# EAGLE design miavita (EAGLE 6.5.0)
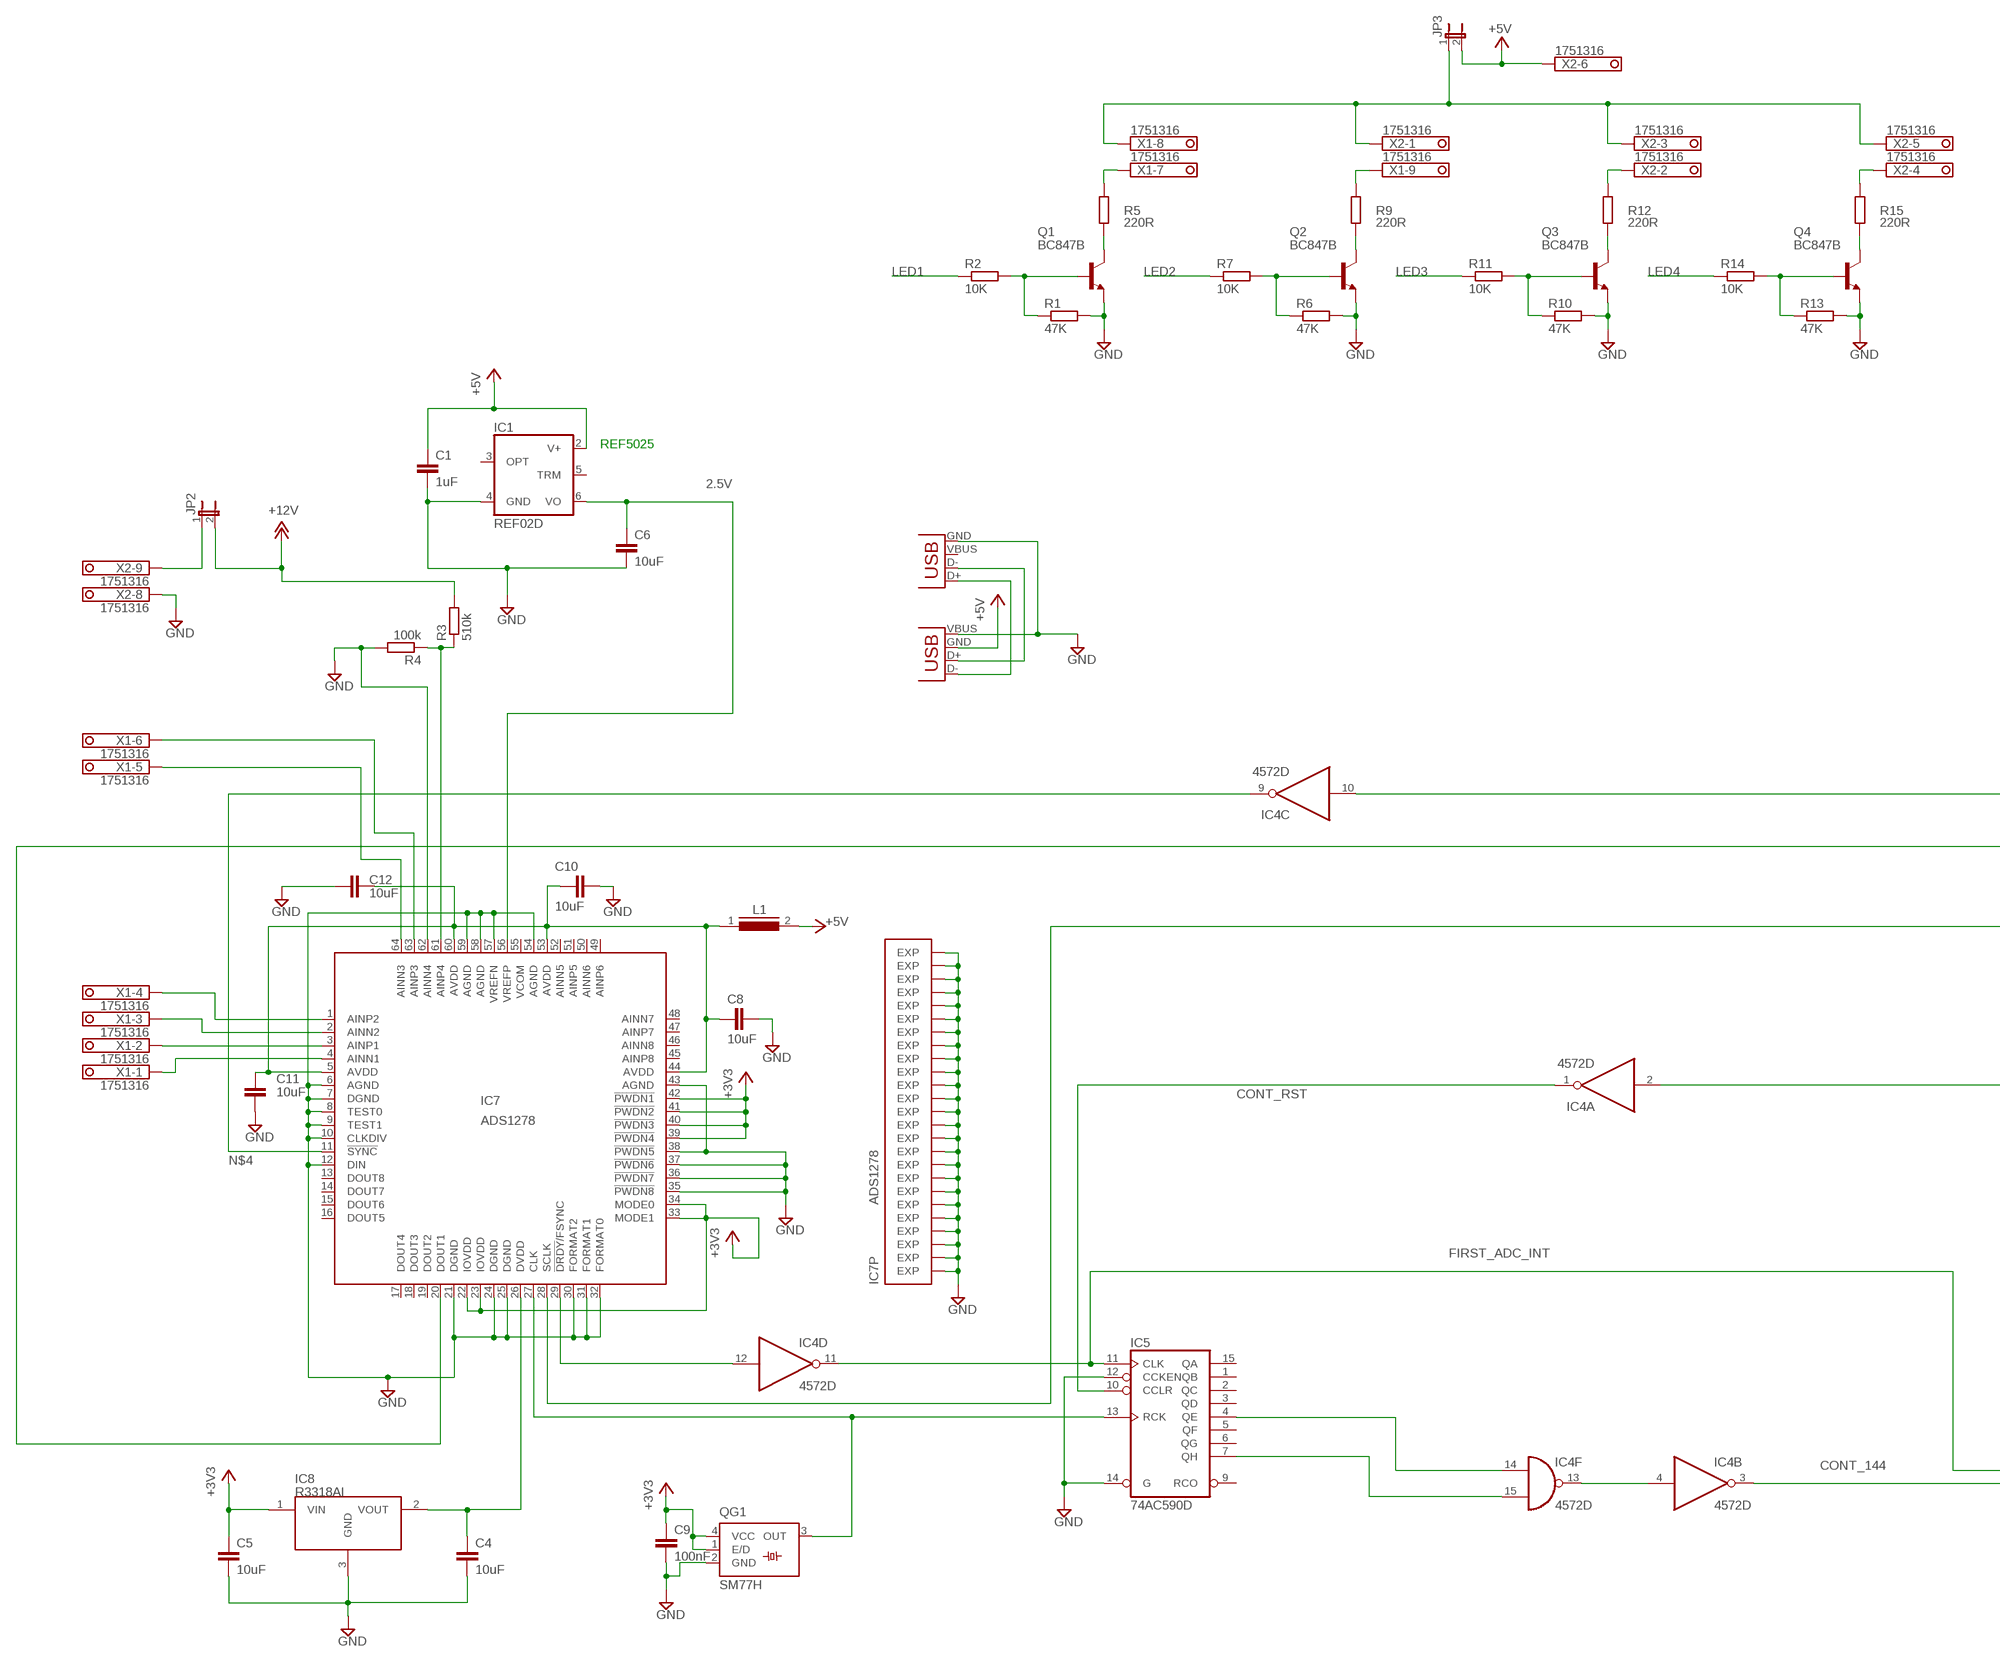
[diagram p0: schematic, sheet 1, part 1 of 2]
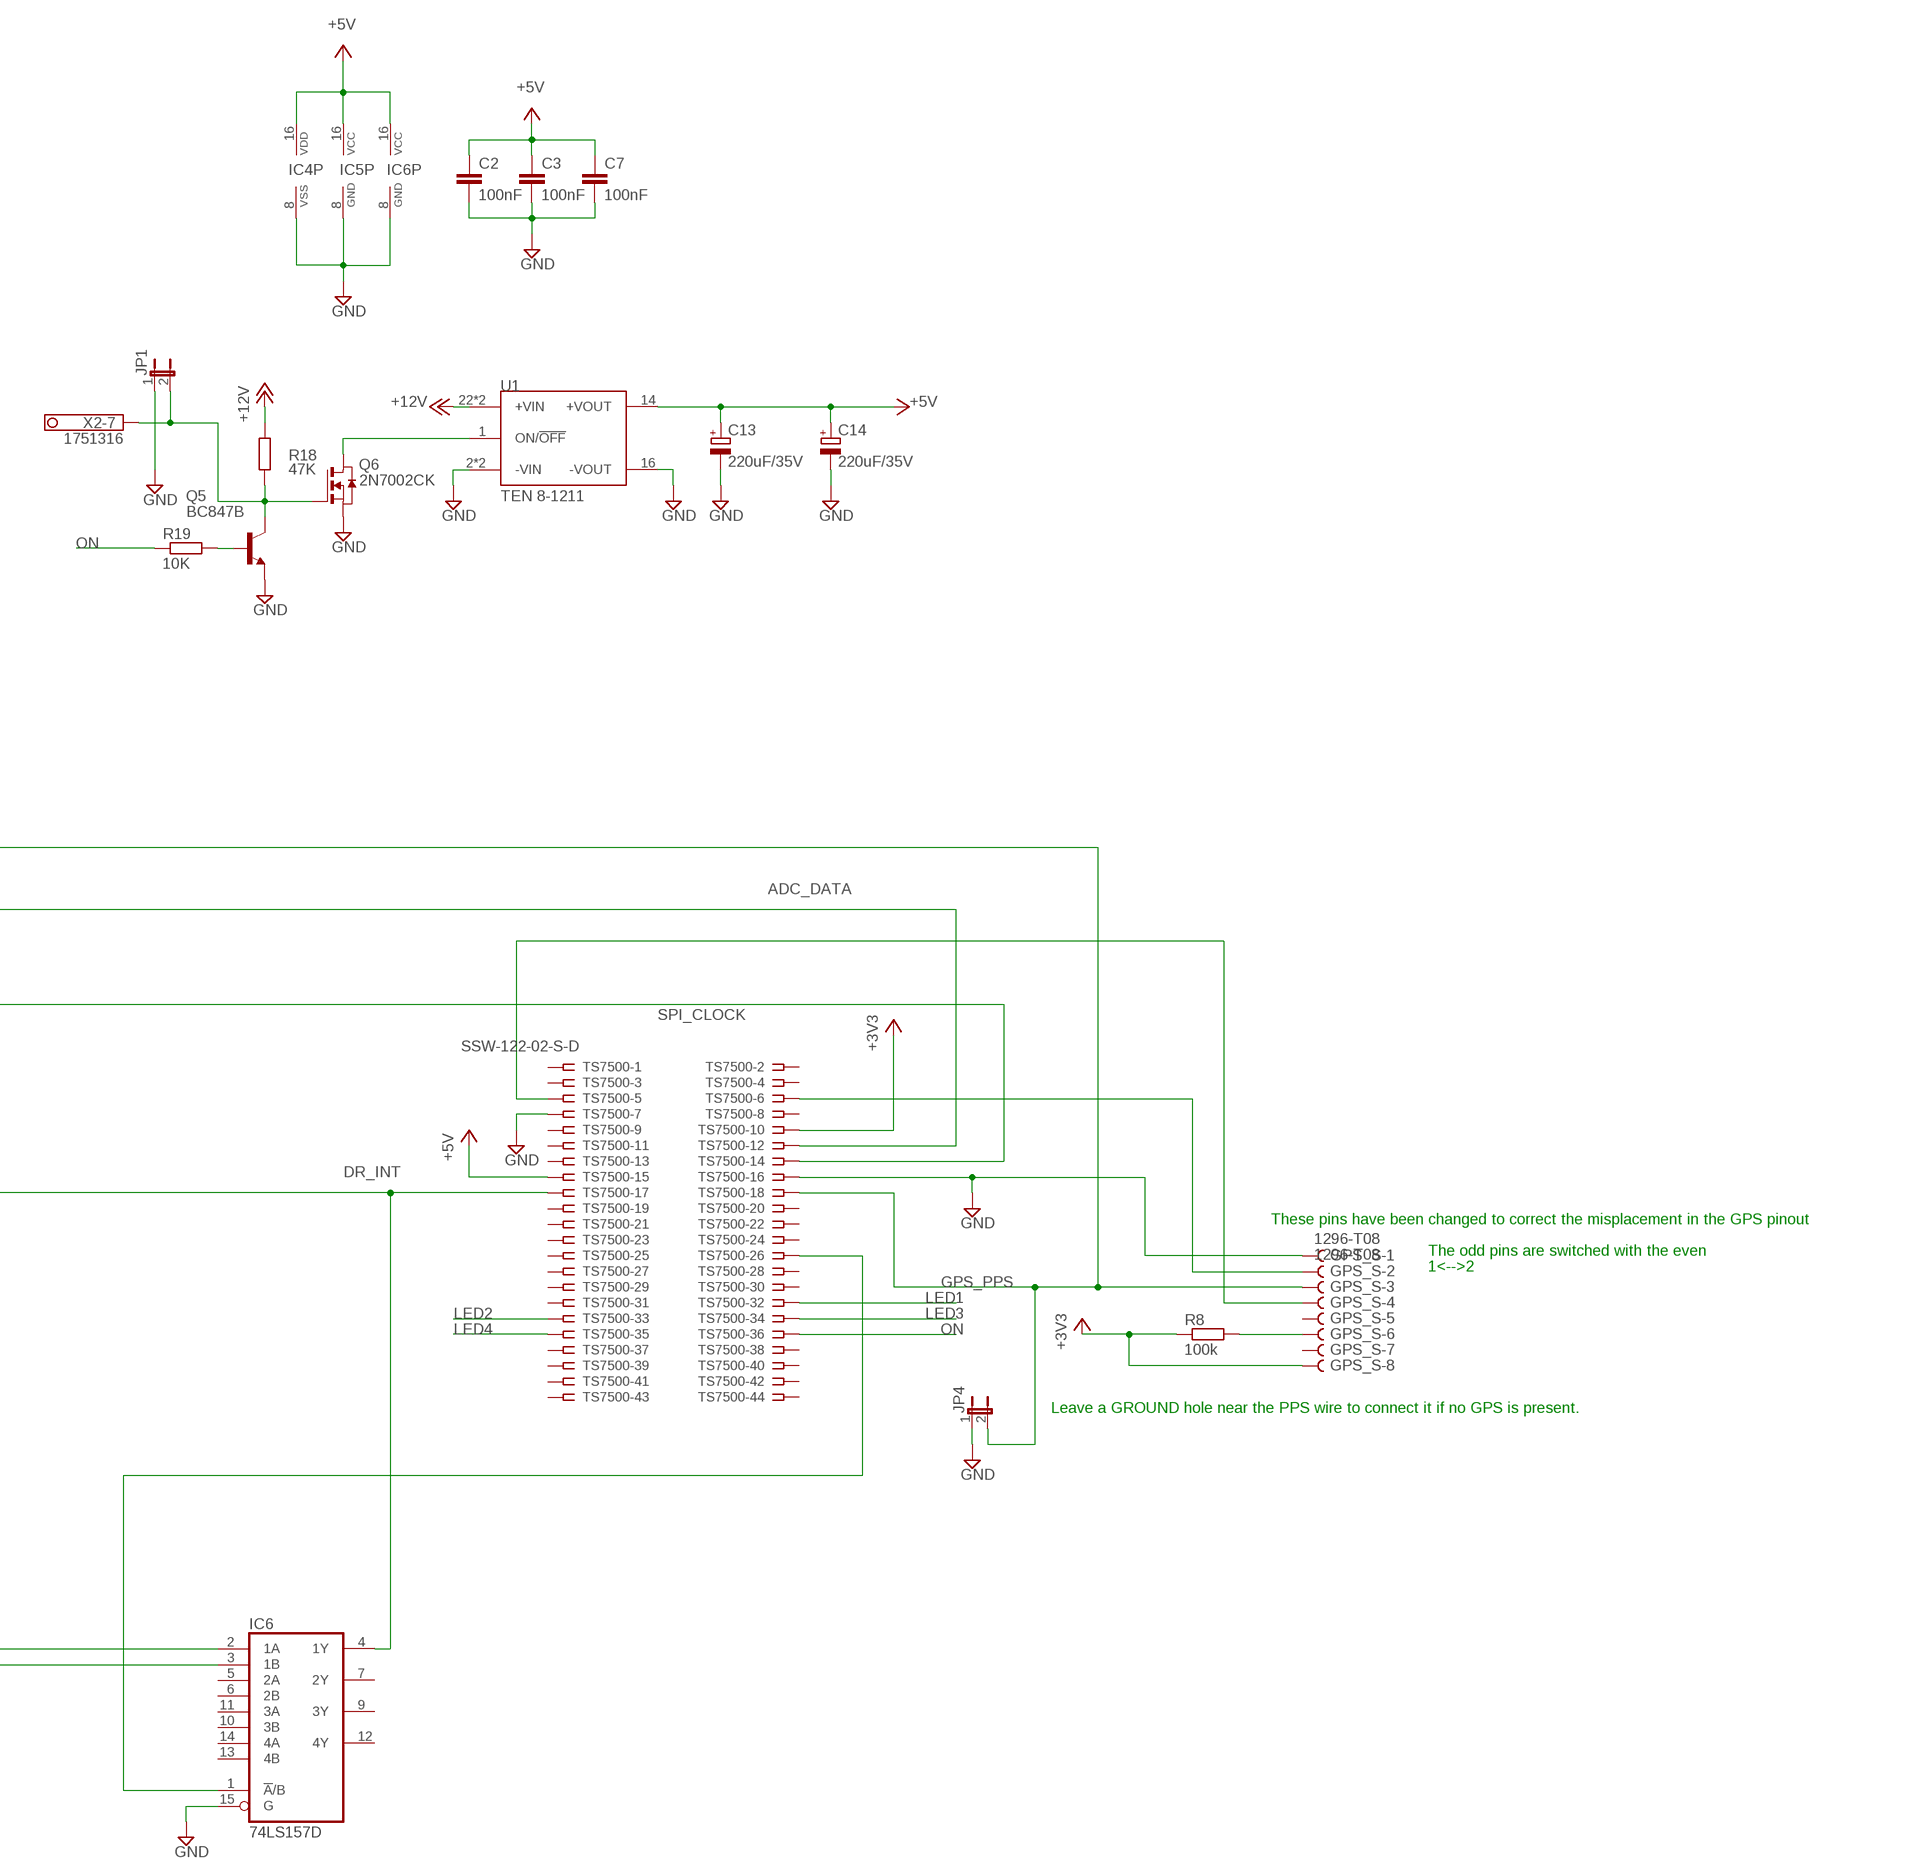
[diagram p1: schematic, sheet 1, part 2 of 2]

## Parts
C1  1uF  C-EUC0603  [C0603]
C2  100nF  C-EUC0603  [C0603]
C3  100nF  C-EUC0603  [C0603]
C4  10uF  C-EUC1210  [C1210]
C5  10uF  C-EUC1210  [C1210]
C6  10uF  C-EUC1210  [C1210]
C7  100nF  C-EUC0603  [C0603]
C8  10uF  C-EUC0805  [C0805]
C9  100nF  C-EUC0603  [C0603]
C10  10uF  C-EUC0805  [C0805]
C11  10uF  C-EUC0805  [C0805]
C12  10uF  C-EUC0805  [C0805]
C13  220uF/35V  CPOL-EUUD-10X10  [UD-10X10_NICHICON]
C14  220uF/35V  CPOL-EUUD-10X10  [UD-10X10_NICHICON]
GPS_S  1296-T08  [1296-08]
IC1  REF02D  [SO08]
IC4  4572D  [SO16]
IC5  74AC590D  [SO16]
IC6  74LS157D  [SO16]
IC7  ADS1278  [HTQFP-64-PAP]
IC8  R3318AI  MCP1525T-I/TT  [SOT23]
JP1  JP1E  [JP1]
JP2  JP1E  [JP1]
JP3  JP1E  [JP1]
JP4  JP1E  [JP1]
L1  FAIR-RITE_2506031027Y0  [L0603]
Q1  BC847B  BC847BLT1SMD  [SOT23]
Q2  BC847B  BC847BLT1SMD  [SOT23]
Q3  BC847B  BC847BLT1SMD  [SOT23]
Q4  BC847B  BC847BLT1SMD  [SOT23]
Q5  BC847B  BC847BLT1SMD  [SOT23]
Q6  2N7002CK  [SOT23]
QG1  SM77H  [SM77H]
R1  47K  R-EU_R0603  [R0603]
R2  10K  R-EU_R0603  [R0603]
R3  510k  R-EU_R0603  [R0603]
R4  100k  R-EU_R0603  [R0603]
R5  220R  R-EU_R0603  [R0603]
R6  47K  R-EU_R0603  [R0603]
R7  10K  R-EU_R0603  [R0603]
R8  100k  R-EU_R0603  [R0603]
R9  220R  R-EU_R0603  [R0603]
R10  47K  R-EU_R0603  [R0603]
R11  10K  R-EU_R0603  [R0603]
R12  220R  R-EU_R0603  [R0603]
R13  47K  R-EU_R0603  [R0603]
R14  10K  R-EU_R0603  [R0603]
R15  220R  R-EU_R0603  [R0603]
R18  47K  R-EU_R0603  [R0603]
R19  10K  R-EU_R0603  [R0603]
TS7500  SSW-122-02-S-D  [SSW-122-02-S-D]
U1  TEN 8-1211  TRACOPOWER_TEN-8-1211  [TRACOPOWER_TEN-8-SERIES]
USBA  USB-A-H  [USB-A-H]
USBB  USBPTH  [USB-B-PTH]
X1  1751316  [1751316]
X2  1751316  [1751316]

## Nets
2.5V: C6.1 IC1.6(VO) IC7.56(VREFP)
+1V8: C4.1 IC7.26(DVDD) IC8.2(VOUT)
+3V3: C5.1 C9.1 GPS_S.8 IC7.22(IOVDD) IC7.23(IOVDD) IC7.33(MODE1) IC7.34(MODE0) IC7.39(!PWDN4) IC7.40(!PWDN3) IC7.41(!PWDN2) IC7.42(!PWDN1) IC8.1(VIN) QG1.1(E/D) QG1.4(VCC) R8.1 TS7500.10
+5V: C1.1 C2.1 C3.1 C7.1 C13.+ C14.+ IC1.2(V+) IC4.16(P:VDD) IC5.16(VCC) IC6.16(VCC) JP3.2 L1.2 TS7500.15 U1.14(+VOUT) USBA.GND(VBUS) X2.6
+12V: JP2.2 R3.2 R18.1 U1.22(+VIN) U1.23(+VIN)
ADC_DATA: IC7.20(DOUT1) TS7500.12
CONT_144: IC4.3(B:O) IC6.3(1B)
CONT_RST: IC4.1(A:O) IC5.10(CCLR)
DR_INT: IC4.2(A:I) IC6.4(1Y) TS7500.17
FIRST_ADC_INT: IC4.11(D:O) IC5.11(CLK) IC6.2(1A)
GND: C1.2 C2.2 C3.2 C4.2 C5.2 C6.2 C7.2 C8.2 C9.2 C10.2 C11.2 C12.2 C13.- C14.- GPS_S.1 IC1.4(GND) IC4.8(P:VSS) IC5.8(GND) IC5.12(CCKEN) IC5.14(G) IC6.8(GND) IC6.15(G) IC7.6(AGND) IC7.7(DGND) IC7.8(TEST0) IC7.9(TEST1) IC7.10(CLKDIV) IC7.12(DIN) IC7.21(DGND) IC7.24(DGND) IC7.25(DGND) IC7.30(FORMAT2) IC7.31(FORMAT1) IC7.32(FORMAT0) IC7.35(!PWDN8) IC7.36(!PWDN7) IC7.37(!PWDN6) IC7.38(!PWDN5) IC7.43(AGND) IC7.54(AGND) IC7.57(VREFN) IC7.58(AGND) IC7.59(AGND) IC7.62(AINN4) IC7.EXP1(EXP) IC7.EXP2(EXP) IC7.EXP3(EXP) IC7.EXP4(EXP) IC7.EXP5(EXP) IC7.EXP6(EXP) IC7.EXP7(EXP) IC7.EXP8(EXP) IC7.EXP9(EXP) IC7.EXP10(EXP) IC7.EXP11(EXP) IC7.EXP12(EXP) IC7.EXP13(EXP) IC7.EXP14(EXP) IC7.EXP15(EXP) IC7.EXP16(EXP) IC7.EXP17(EXP) IC7.EXP18(EXP) IC7.EXP19(EXP) IC7.EXP20(EXP) IC7.EXP21(EXP) IC7.EXP22(EXP) IC7.EXP23(EXP) IC7.EXP24(EXP) IC7.EXP25(EXP) IC8.3(GND) JP1.1 JP4.1 Q1.2(E) Q2.2(E) Q3.2(E) Q4.2(E) Q5.2(E) Q6.2(S) QG1.2(GND) R1.2 R4.2 R6.2 R10.2 R13.2 TS7500.7 TS7500.16 U1.2(-VIN) U1.3(-VIN) U1.16(-VOUT) USBA.VBUS(GND) USBB.GND X2.8
GPS_PPS: GPS_S.3 IC4.10(C:I) JP4.2 TS7500.18
LED1: R2.1 TS7500.32
LED2: R7.1 TS7500.33
LED3: R11.1 TS7500.34
LED4: R14.1 TS7500.35
N$1: IC6.1(!A!/B) TS7500.26
N$2: IC4.15(F:I1) IC5.7(QH)
N$3: IC4.14(F:I0) IC5.4(QE)
N$4: IC4.9(C:O) IC7.11(!SYNC)
N$5: IC4.4(B:I) IC4.13(F:O)
N$7: IC4.12(D:I) IC7.29(!DRDY!/FSYNC)
N$8: IC7.3(AINP1) X1.2
N$9: Q5.1(B) R19.2
N$10: IC7.4(AINN1) X1.1
N$11: IC7.1(AINP2) X1.4
N$12: IC7.61(AINP4) R3.1 R4.1
N$13: USBA.D+(D-) USBB.D-
N$14: IC7.63(AINP3) X1.6
N$15: Q2.1(B) R6.1 R7.2
N$16: Q2.3(C) R9.1
N$17: IC5.13(RCK) IC7.27(CLK) QG1.3(OUT)
N$18: USBA.D-(D+) USBB.D+
N$19: C8.1 C10.1 C11.1 C12.1 IC7.5(AVDD) IC7.44(AVDD) IC7.53(AVDD) IC7.60(AVDD) L1.1
N$20: R9.2 X1.9
N$21: Q3.1(B) R10.1 R11.2
N$22: Q3.3(C) R12.1
N$23: R12.2 X2.2
N$24: Q4.1(B) R13.1 R14.2
N$25: Q4.3(C) R15.1
N$26: R15.2 X2.4
N$27: JP2.1 X2.9
N$28: JP3.1 X1.8 X2.1 X2.3 X2.5
N$29: IC7.2(AINN2) X1.3
N$31: JP1.2 Q5.3(C) Q6.1(G) R18.2 X2.7
N$32: Q6.3(D) U1.1(ON/!OFF)
N$34: IC7.64(AINN3) X1.5
N$37: Q1.3(C) R5.1
N$39: Q1.1(B) R1.1 R2.2
N$40: R5.2 X1.7
N$42: GPS_S.2 TS7500.6
N$43: GPS_S.4 TS7500.5
N$44: GPS_S.6 R8.2
ON: R19.1 TS7500.36
SPI_CLOCK: IC7.28(SCLK) TS7500.14
Unconnected: GPS_S.5 GPS_S.7 IC1.3(OPT) IC1.5(TRM) IC4.5(E:O) IC4.6(E:I0) IC4.7(E:I1) IC5.1(QB) IC5.2(QC) IC5.3(QD) IC5.5(QF) IC5.6(QG) IC5.9(RCO) IC5.15(QA) IC6.5(2A) IC6.6(2B) IC6.7(2Y) IC6.9(3Y) IC6.10(3B) IC6.11(3A) IC6.12(4Y) IC6.13(4B) IC6.14(4A) IC7.13(DOUT8) IC7.14(DOUT7) IC7.15(DOUT6) IC7.16(DOUT5) IC7.17(DOUT4) IC7.18(DOUT3) IC7.19(DOUT2) IC7.45(AINP8) IC7.46(AINN8) IC7.47(AINP7) IC7.48(AINN7) IC7.49(AINP6) IC7.50(AINN6) IC7.51(AINP5) IC7.52(AINN5) IC7.55(VCOM) TS7500.1 TS7500.2 TS7500.3 TS7500.4 TS7500.8 TS7500.9 TS7500.11 TS7500.13 TS7500.19 TS7500.20 TS7500.21 TS7500.22 TS7500.23 TS7500.24 TS7500.25 TS7500.27 TS7500.28 TS7500.29 TS7500.30 TS7500.31 TS7500.37 TS7500.38 TS7500.39 TS7500.40 TS7500.41 TS7500.42 TS7500.43 TS7500.44 USBB.VBUS

## Notes on the sheet
- REF5025
- These pins have been changed to correct the misplacement in the GPS pinout
- The odd pins are switched with the even
- 1<-->2
- Leave a GROUND hole near the PPS wire to connect it if no GPS is present.

## Library data of the parts
C1-C12 = resistor:C-EU: CAPACITOR, European symbol
C13 C14 = rcl:CPOL-EU: POLARIZED CAPACITOR, European symbol
GPS_S = con-leotronics:1296-T08: 1.27mm SINGLE ROW FEMALE SOCKET Source: http://www.leotronics.co.uk/Conexcon/Data%20Sheets/sec.%20A/1296ing.pdf; OC_FARNELL: unknown; OC_NEWARK: unknown
IC1 = linear:REF02: VOLTAGE REFERENCE
IC4 = 45xx:4572: INVERTER/OR/NOR (MC14572BCP)
IC5 = 74xx-eu:74*590: 8-bit binary COUNTER, output register
IC6 = 74xx-eu:74*157: Quadruple 2-line to 1-line data SELECTOR/MULTIPLEXER
IC7 = texas:ADS1278: Quad/Octal, Simultaneous Sampling, 24-Bit Analog-to-Digital Converters ADS1274 / ADS1278 Auto generated by make-symbol-device-package-bsdl.ulp Rev. 29 Source: http://focus.ti.com/lit/ds/symlink/ads1274.pdf; MPN: ADS1278IPAPT; OC_FARNELL: 1603419; OC_NEWARK: 50M8811
IC8 = referencias:MCP1525: 2.5V Voltage Reference; OC_FARNELL: 9758500
JP1-JP4 = jumper:JP1E: JUMPER
L1 = bobinas:FAIR-RITE_25*1027Y0: SMD EMI Suppression Ferrite Beads; OC_FARNELL: 1463451
Q1-Q5 = transistor-npn:BC847*: NPN Transistor
Q6 = mosfet:2N7002: N-channel TrenchMOS FET; OC_FARNELL: 1829183
QG1 = crystal:SM77H: 3.3V CMOS Clock Oscillator Source: www.pletronics.com .. sm77h%203.3v.pdf; OC_FARNELL: unknown; OC_NEWARK: unknown
R1-R15 R18 R19 = resistor:R-EU_: RESISTOR, European symbol
TS7500 = con-samtec:SSW-122-02-S-D: THROUGH-HOLE .025" SQ POST SOCKET Source: Samtec SSW.pdf; MPN: SSW-122-02-S-D; OC_FARNELL: unknown; OC_NEWARK: 11P9673
U1 = alimentacoes:TRACOPOWER_TEN-8-*: Traco Power TEN 8 series single output isolated voltage regulator
USBA USBB = SparkFun:USB: USB Connectors USB-B-PTH is fully proven SKU : PRT-00139 USB-miniB is fully proven SKU : PRT-00587 USB-A-PCB is untested. USB-A-H is throughly reviewed, but untested. Spark Fun Electronics SKU : PRT-00437 USB-B-SMT is throughly reviewed, but untested. Needs silkscreen touching up. USB-A-S has not been used/tested USB-MB-H has not been used/tested
X1 X2 = con-phoenix-350:1751316: MKDS 1/ 9-3,5 Printklemme Nennstrom: 10 A Bemessungsspannung: 160 V Raster: 3,5 mm Polzahl: 9 Montageart: Löten Anschlussart: Schraubanschluss Anschlussrichtung vom Leiter zur Platine: 0° Source: http://eshop.phoenixcontact.com .. 1751316.pdf; OC_FARNELL: unknown; OC_NEWARK: unknown

## Board
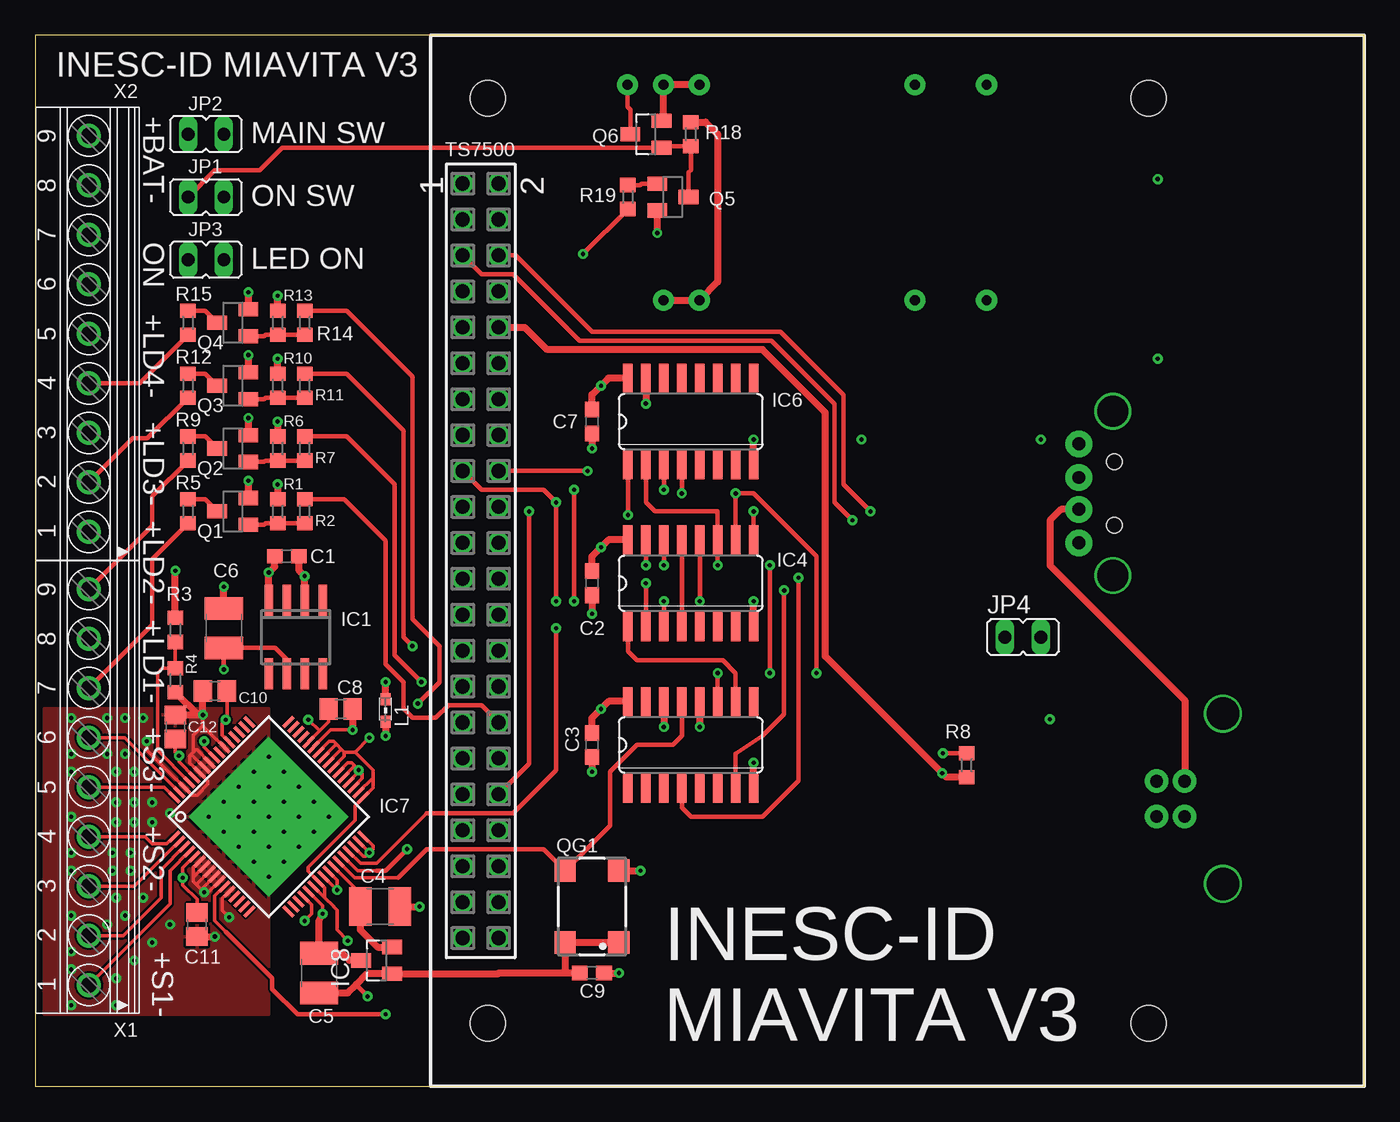
[diagram p2: board, top side]
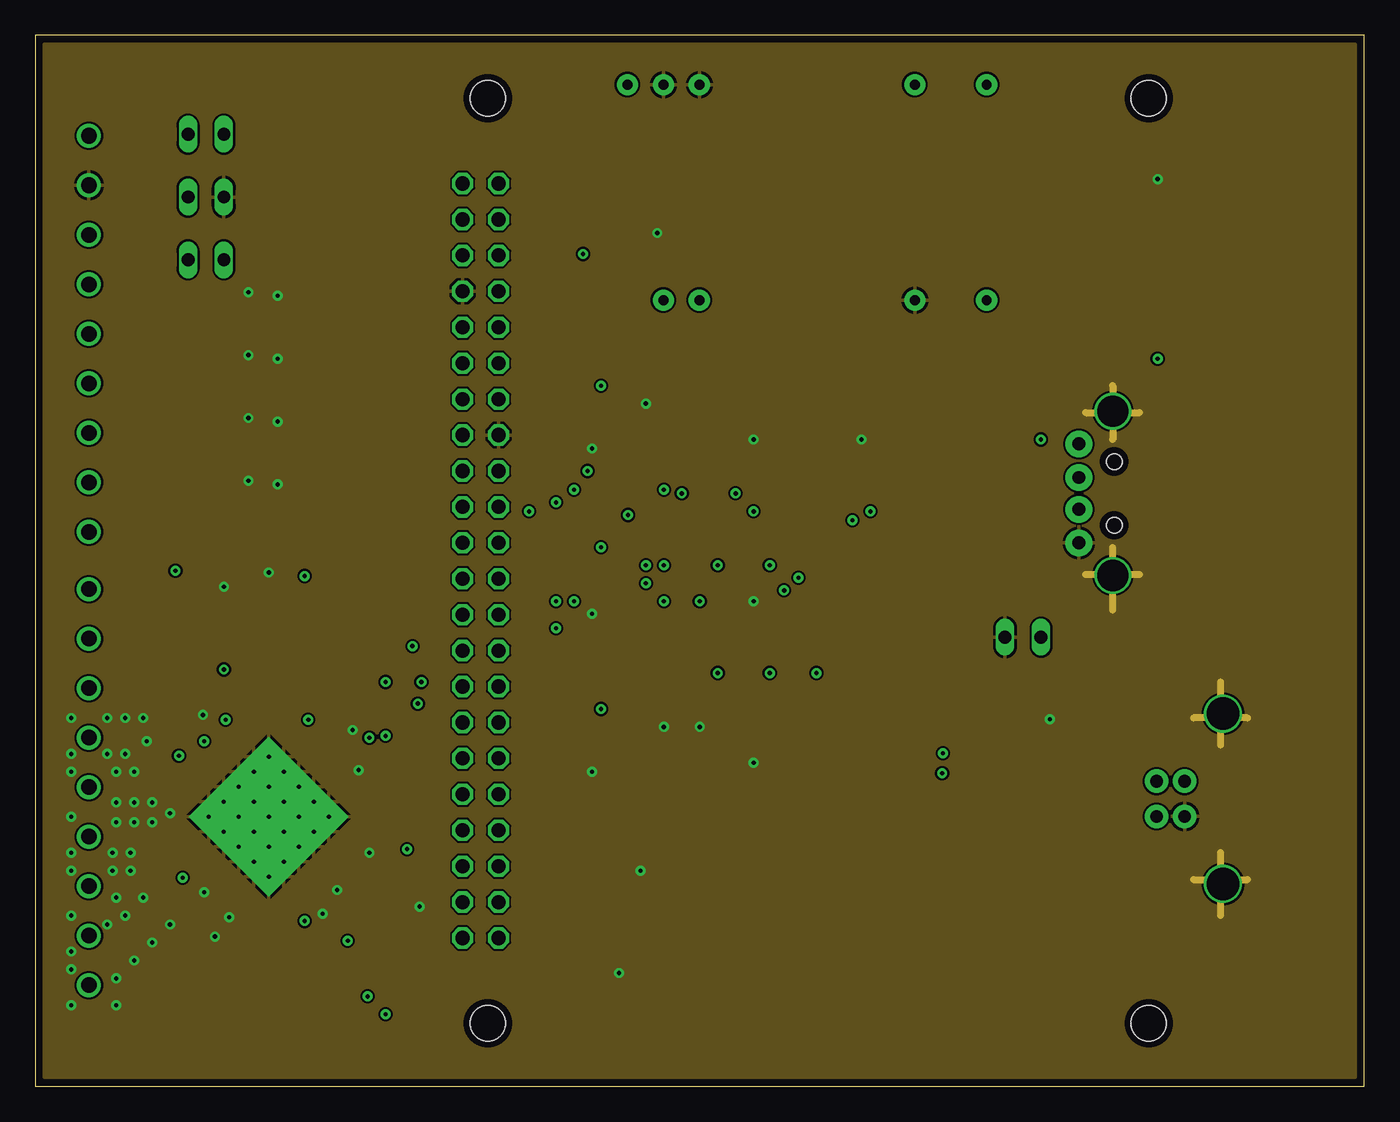
[diagram p3: board, inner layer GND]
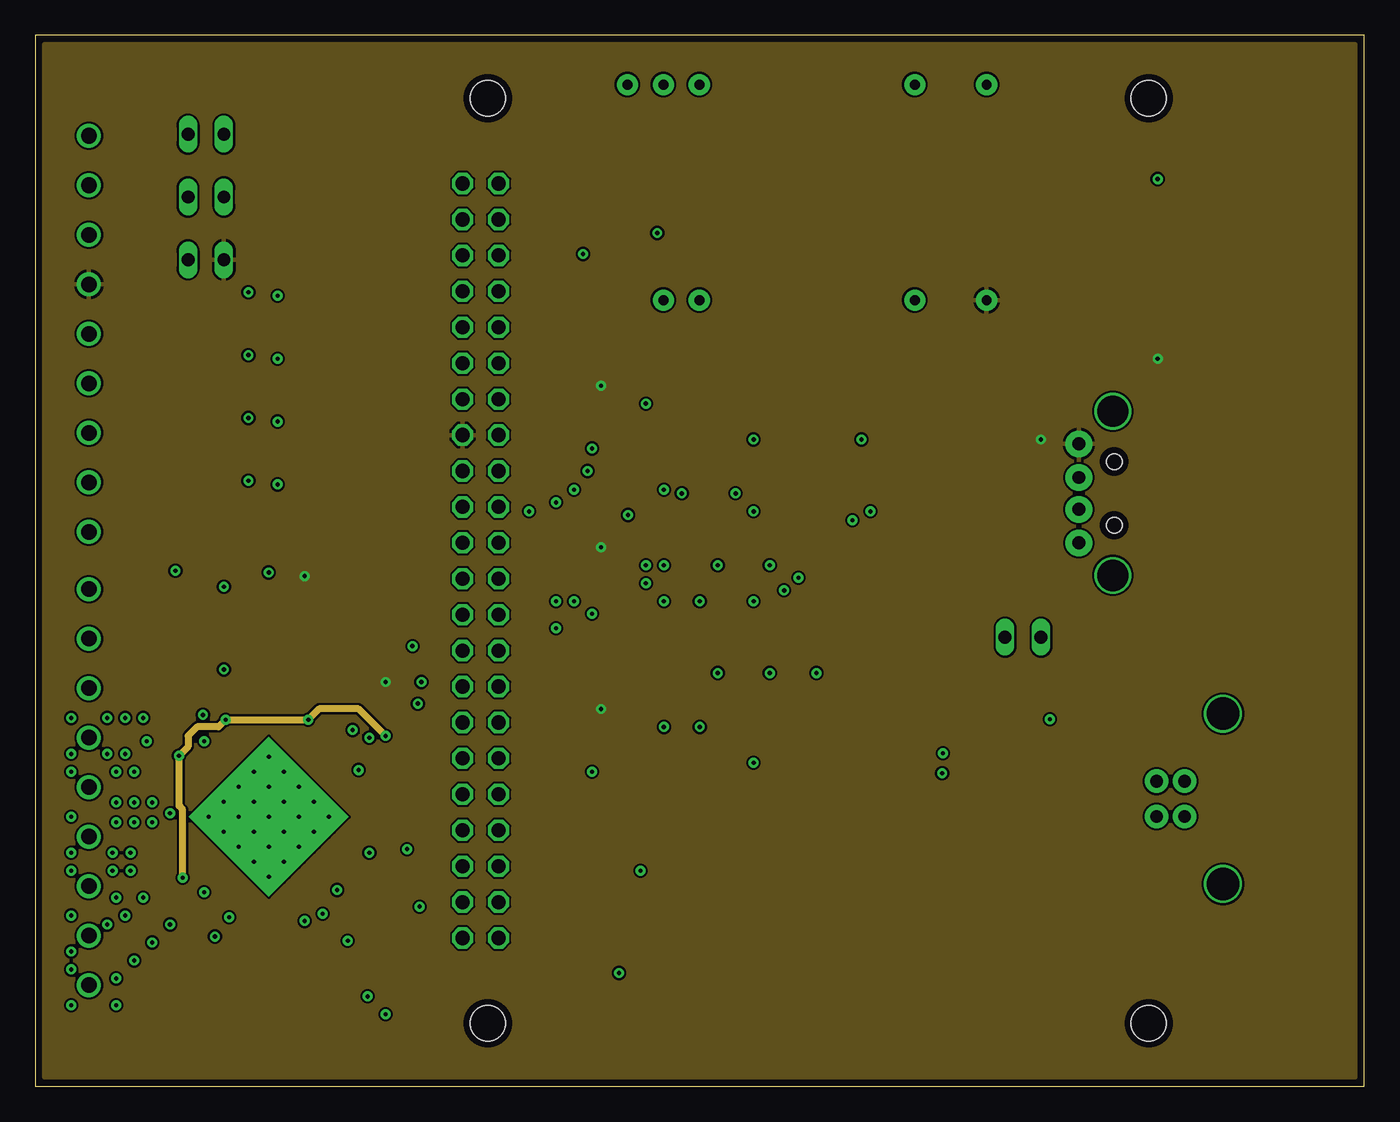
[diagram p4: board, inner layer PWR]
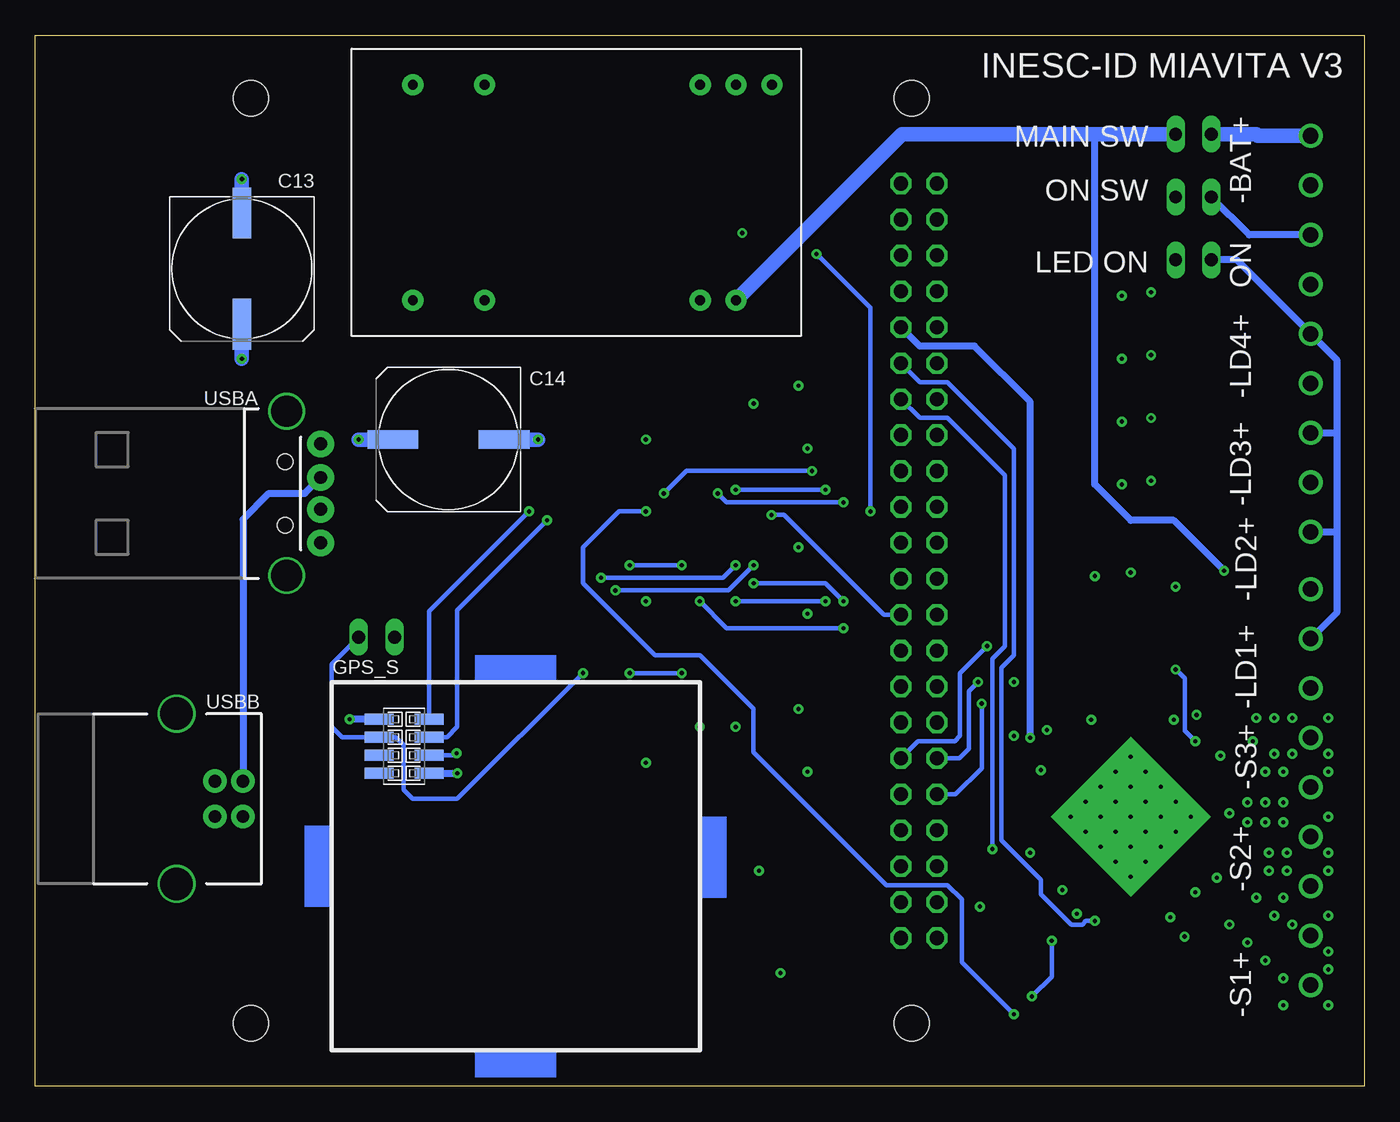
[diagram p5: board, bottom side, seen from below]

Size 93.98 x 74.3 mm. Coordinates in mm from the lower left corner, seen from the top.
Outline: 0,0 93.98,0 93.98,74.3 0,74.3 0,0
Copper layers (1*2*3*16): Top 0.018mm / dielectric 0.36mm / GND 0.035mm / dielectric 0.71mm / PWR 0.035mm / dielectric 0.36mm / Bottom 0.018mm
Design rules "default": minimum track width 0.15mm, minimum drill 0.25mm, track to track 0.15mm, track to pad 0.15mm, pad to pad 0.15mm, via to via 0.15mm, smd to smd 0.15mm, copper to edge 0.45mm, drill to drill 0.3mm, minimum pad ring 0.2mm, minimum via ring 0.2mm, stop-mask expansion 0.1mm, vias tented up to drill 0.5mm, thermal gap 0.2mm
Holes 2.5 mm at 32,69.85 78.74,69.85 78.74,4.45 32,4.45
tKeepout: area 0,26 to 0,26

### Footprints (pad centres in the part's own frame; a part is rotated, then mirrored left to right if it is on the bottom)
C0603 = smd 1.1 x 1: 1 -0.85,0; 2 0.85,0
C1210 = smd 1.6 x 2.7: 1 -1.4,0; 2 1.4,0
C0805 = smd 1.3 x 1.5: 1 -0.85,0; 2 0.85,0
UD-10X10_NICHICON = smd 3.6 x 1.3: + 3.925,0; - -3.95,0
1296-08 = smd 0.76 x 2.05: 1 -1.905,-1.78; 2 -1.905,1.78; 3 -0.635,-1.78; 4 -0.635,1.78; 5 0.635,-1.78; 6 0.635,1.78; 7 1.905,-1.78; 8 1.905,1.78
SO08 = smd 0.6 x 2.2: 1 -1.905,-2.6; 2 -0.635,-2.6; 3 0.635,-2.6; 4 1.905,-2.6; 5 1.905,2.6; 6 0.635,2.6; 7 -0.635,2.6; 8 -1.905,2.6
SO16 = smd 0.66 x 2.032: 1 -4.445,-3.073; 2 -3.175,-3.073; 3 -1.905,-3.073; 4 -0.635,-3.073; 5 0.635,-3.073; 6 1.905,-3.073; 7 3.175,-3.073; 8 4.445,-3.073; 9 4.445,3.073; 10 3.175,3.073; 11 1.905,3.073; 12 0.635,3.073; 13 -0.635,3.073; 14 -1.905,3.073; 15 -3.175,3.073; 16 -4.445,3.073
HTQFP-64-PAP = smd 1 x 0.25: 1 -5.7,3.75; 2 -5.7,3.25; 3 -5.7,2.75; 4 -5.7,2.25; 5 -5.7,1.75; 6 -5.7,1.25; 7 -5.7,0.75; 8 -5.7,0.25; 9 -5.7,-0.25; 10 -5.7,-0.75; 11 -5.7,-1.25; 12 -5.7,-1.75; 13 -5.7,-2.25; 14 -5.7,-2.75; 15 -5.7,-3.25; 16 -5.7,-3.75; 33 5.7,-3.75; 34 5.7,-3.25; 35 5.7,-2.75; 36 5.7,-2.25; 37 5.7,-1.75; 38 5.7,-1.25; 39 5.7,-0.75; 40 5.7,-0.25; 41 5.7,0.25; 42 5.7,0.75; 43 5.7,1.25; 44 5.7,1.75; 45 5.7,2.25; 46 5.7,2.75; 47 5.7,3.25; 48 5.7,3.75 | smd 0.25 x 1: 17 -3.75,-5.7; 18 -3.25,-5.7; 19 -2.75,-5.7; 20 -2.25,-5.7; 21 -1.75,-5.7; 22 -1.25,-5.7; 23 -0.75,-5.7; 24 -0.25,-5.7; 25 0.25,-5.7; 26 0.75,-5.7; 27 1.25,-5.7; 28 1.75,-5.7; 29 2.25,-5.7; 30 2.75,-5.7; 31 3.25,-5.7; 32 3.75,-5.7; 49 3.75,5.7; 50 3.25,5.7; 51 2.75,5.7; 52 2.25,5.7; 53 1.75,5.7; 54 1.25,5.7; 55 0.75,5.7; 56 0.25,5.7; 57 -0.25,5.7; 58 -0.75,5.7; 59 -1.25,5.7; 60 -1.75,5.7; 61 -2.25,5.7; 62 -2.75,5.7; 63 -3.25,5.7; 64 -3.75,5.7 | drill 0.3 pad 2 square: EXP1 -3,3; EXP2 -1.5,3; EXP3 0,3; EXP4 1.5,3; EXP5 3,3; EXP6 -3,1.5; EXP7 -1.5,1.5; EXP8 0,1.5; EXP9 1.5,1.5; EXP10 3,1.5; EXP11 -3,0; EXP12 -1.5,0; EXP13 0,0; EXP14 1.5,0; EXP15 3,0; EXP16 -3,-1.5; EXP17 -1.5,-1.5; EXP18 0,-1.5; EXP19 1.5,-1.5; EXP20 3,-1.5; EXP21 -3,-3; EXP22 -1.5,-3; EXP23 0,-3; EXP24 1.5,-3; EXP25 3,-3
SOT23 = smd 1 x 1.4: 1 -0.95,-1.1; 2 0.95,-1.1; 3 0,1.1
JP1 = drill 0.914 long: 1 0,-1.27; 2 0,1.27
L0603 = smd 0.85 x 0.7: 1 -0.9,0; 2 0.7,0
SM77H = smd 1.6 x 1.5: 1 -2.55,-1.9; 2 2.55,-1.9; 3 2.55,1.9; 4 -2.55,1.9
R0603 = smd 1 x 1.1: 1 -0.85,0; 2 0.85,0
SSW-122-02-S-D = drill 1 pad 1.5 octagon: 1 -26.67,-1.27; 2 -26.67,1.27; 3 -24.13,-1.27; 4 -24.13,1.27; 5 -21.59,-1.27; 6 -21.59,1.27; 7 -19.05,-1.27; 8 -19.05,1.27; 9 -16.51,-1.27; 10 -16.51,1.27; 11 -13.97,-1.27; 12 -13.97,1.27; 13 -11.43,-1.27; 14 -11.43,1.27; 15 -8.89,-1.27; 16 -8.89,1.27; 17 -6.35,-1.27; 18 -6.35,1.27; 19 -3.81,-1.27; 20 -3.81,1.27; 21 -1.27,-1.27; 22 -1.27,1.27; 23 1.27,-1.27; 24 1.27,1.27; 25 3.81,-1.27; 26 3.81,1.27; 27 6.35,-1.27; 28 6.35,1.27; 29 8.89,-1.27; 30 8.89,1.27; 31 11.43,-1.27; 32 11.43,1.27; 33 13.97,-1.27; 34 13.97,1.27; 35 16.51,-1.27; 36 16.51,1.27; 37 19.05,-1.27; 38 19.05,1.27; 39 21.59,-1.27; 40 21.59,1.27; 41 24.13,-1.27; 42 24.13,1.27; 43 26.67,-1.27; 44 26.67,1.27
TRACOPOWER_TEN-8-SERIES = drill 0.7 pad 1.5: 1 -12.7,-7.62; 2 -10.16,-7.62; 3 -7.62,-7.62; 9 7.62,-7.62; 11 12.7,-7.62; 14 12.7,7.62; 16 7.62,7.62; 22 -7.62,7.62; 23 -10.16,7.62
USB-A-H = drill 0.914 pad 1.88: D+ 2.4,1.127; D- 2.4,-1.127; GND 2.4,3.5; VBUS 2.4,-3.5 | drill 2.2: GND2 0,-5.8; GND3 0,5.8 | hole 1.1: -0.1,2.25; -0.1,-2.25
USB-B-PTH = drill 0.914 pad 1.676: D+ 0,1.25; D- 1.981,1.25; GND 0,-1.25; VBUS 1.981,-1.25 | drill 2.286: S1 -2.718,-6.02; S2 -2.718,6.02
1751316 = drill 1.1 pad 1.7: 1 -13.973,-0.1; 2 -10.473,-0.1; 3 -6.973,-0.1; 4 -3.473,-0.1; 5 0.028,-0.1; 6 3.527,-0.1; 7 7.027,-0.1; 8 10.527,-0.1; 9 14.027,-0.1

### Placement (x,y rotation side)
C1  17.78,37.47 180 top
C2  39.37,35.56 270 top
C3  39.37,24.13 270 top
C4  24.38,12.7 0 top
C5  20.07,8 90 top
C6  13.34,32.38 90 top
C7  39.37,46.99 270 top
C8  21.59,26.67 0 top
C9  39.37,8 0 top
C10  12.7,27.94 180 top
C11  11.43,11.43 270 top
C12  9.91,25.4 90 top
C13  79.38,57.78 270 bottom
C14  64.77,45.72 180 bottom
GPS_S  67.9,24.04 270 bottom
IC1  18.41,31.75 180 top
IC4  46.35,35.56 0 top
IC5  46.35,24.13 0 top
IC6  46.35,46.99 0 top
IC7  16.51,19.05 45 top
IC8  24.13,8.89 90 top
JP1  12.06,62.87 90 top
JP2  12.06,67.31 270 top
JP3  12.06,58.42 270 top
JP4  69.85,31.75 270 top
L1  24.77,26.67 90 top
Q1  13.97,40.64 90 top
Q2  13.97,45.09 90 top
Q3  13.97,49.53 90 top
Q4  13.97,53.98 90 top
Q5  45.09,62.87 270 top
Q6  43.18,67.31 90 top
QG1  39.37,12.7 90 top
R1  17.14,40.64 90 top
R2  19.05,40.64 270 top
R3  9.91,32.26 90 top
R4  9.91,28.7 270 top
R5  10.79,40.64 270 top
R6  17.14,45.09 90 top
R7  19.05,45.09 270 top
R8  65.86,22.7 90 top
R9  10.79,45.09 270 top
R10  17.14,49.53 90 top
R11  19.05,49.53 270 top
R12  10.79,49.53 270 top
R13  17.14,53.98 90 top
R14  19.05,53.98 270 top
R15  10.79,53.98 270 top
R18  46.35,67.31 270 top
R19  41.91,62.87 90 top
TS7500  31.5,37.15 270 top
U1  54.58,63.19 180 bottom
USBA  76.2,41.91 0 bottom
USBB  81.28,20.32 0 bottom
X1  3.68,21.11 90 top
X2  3.68,53.17 90 top

### Tracks (layer width: path | path; a pad name or v marks a point on that pad's centre or on a via)
2.5V  (via drill 0.3 pad 0.7)
  Top 0.254: IC7.56 11.94,23.98 v11.94,24.38
  Top 0.305: IC1.6 17.78,30.17 16.97,30.98 C6.1 v13.34,29.46
  Bottom 0.305: v11.94,24.38 12.7,25.15 12.7,28.83 v13.34,29.46
+1V8
  Top 0.254: IC7.26 22.98,13.64 C4.1
  Top 0.508: C4.1 22.98,11.05 24.2,9.84 IC8.2
+3V3  (via drill 0.3 pad 0.7)
  Top 0.254: IC7.42 20.78,24.38 21.08,24.38 21.34,24.13 | 21.34,24.13 21.59,23.88 | 21.59,23.88 21.84,23.62 | 21.84,23.62 21.84,23.32 IC7.39 | IC7.41 21.24,24.13 21.34,24.13 | IC7.40 21.59,23.78 21.59,23.88 | 23.88,21.82 IC7.34 | 23.88,21.82 23.88,22.35 22.61,23.62 | 22.61,23.62 21.84,23.62 | 23.88,21.82 23.88,21.11 IC7.33 22.61,19.84 22.61,18.8 19.3,15.49 19.3,15.2 IC7.23 20.45,14.05 20.45,13.34 | IC7.22 20.45,13.34 | 20.45,13.34 21.08,12.71 21.08,12.7 21.34,12.45 21.34,11.05 v22.1,10.29 | v23.62,24.64 22.61,23.62
  Top 0.305: v23.5,6.35 22.67,7.18
  Top 0.508: C5.1 22.09,6.6 22.67,7.18 23.43,7.94 IC8.1 32.7,7.94 32.77,8 37.47,8 | QG1.1 QG1.4 37.47,8 | R8.1 64.42,21.84 v64.14,22.13 55.88,30.39 55.88,47.62 51.44,52.07 36.2,52.07 34.61,53.66 TS7500.10 | C9.1 37.47,8
  Bottom 0.305: v22.1,10.29 22.1,7.75 v23.5,6.35
  Bottom 0.508: v23.62,24.64 23.62,48.39 27.56,52.32 31.43,52.32 TS7500.10 | GPS_S.8 v64.14,22.13
+5V  (via drill 0.3 pad 0.7)
  Top 0.508: IC1.2 v19.05,36.07 18.63,36.49 C1.1 | L1.2 v24.77,28.57 | C7.1 39.37,48.9 v40.01,49.53 40.54,50.06 IC6.16 | C2.1 39.37,37.47 v40.01,38.1 40.54,38.63 IC4.16 | C3.1 39.37,26.04 v40.01,26.67 40.54,27.2 IC5.16
  Bottom 1.016: C14.+ v71.12,45.72 | v79.38,51.44 C13.+
  pour PWR: 0.64,73.66 93.34,73.66 93.34,0.64 0.64,0.64
+12V  (via drill 0.3 pad 0.7)
  Top 0.508: U1.23 U1.22 48.26,56.87 48.26,67.31 47.41,68.16 R18.1 | R3.2 v9.91,36.45
  Bottom 0.508: v9.91,36.45 13.46,40.01 16.51,40.01 19.05,42.55 19.05,67.31
  Bottom 1.016: JP2.2 19.05,67.31 32.68,67.31 U1.23
ADC_DATA  (via drill 0.3 pad 0.7)
  Top 0.254: v19.05,11.68 19.56,12.19 19.56,12.82 IC7.20
  Bottom 0.305: TS7500.12 31.43,49.78 29.46,49.78 24.77,45.09 24.77,30.48 25.65,29.59 25.65,17.4 22.86,14.61 22.86,13.59 20.7,11.43 19.94,11.43 19.68,11.68 v19.05,11.68
CONT_144  (via drill 0.3 pad 0.7)
  Top 0.305: IC4.3 v44.45,34.29 | v38.1,34.29 v38.1,42.16 | v44.45,42.16 IC6.3
  Bottom 0.305: v44.45,34.29 v38.1,34.29 | v38.1,42.16 v44.45,42.16
CONT_RST
  Top 0.305: IC4.1 41.91,30.73 42.55,30.1 48.64,30.1 49.53,29.21 IC5.10
DR_INT  (via drill 0.3 pad 0.7)
  Top 0.305: IC6.4 v45.72,41.91 | v36.83,34.29 v36.83,41.27 35.94,42.16 31.56,42.16 TS7500.17 | IC4.2 v43.18,35.56
  Bottom 0.305: v45.72,41.91 45.09,41.27 v36.83,41.27 | v36.83,34.29 38.1,35.56 v43.18,35.56
FIRST_ADC_INT  (via drill 0.3 pad 0.7)
  Top 0.305: v48.26,36.83 IC4.11 48.26,40.64 43.81,40.64 43.18,41.27 IC6.2 | v51.94,36.83 v51.94,29.21 | v48.26,29.21 IC5.11
  Bottom 0.305: v48.26,36.83 v51.94,36.83 | v51.94,29.21 v48.26,29.21
GND  (via drill 0.3 pad 0.7)
  Top 0.254: IC7.6 11.18,15.48 11.18,14.78 | 11.43,14.22 11.18,14.48 11.18,14.78 | 11.43,14.22 11.68,13.97 | 11.68,13.97 v11.94,13.72 12.24,13.72 IC7.10 | IC7.9 11.78,13.97 11.68,13.97 | IC7.8 11.43,14.32 11.43,14.22 | IC7.7 11.18,14.78 | IC7.12 13.21,13.27 13.21,12.45 v13.72,11.94 | v7.87,24.38 7.87,23.8 IC7.62 11.1,20.57 11.43,20.57 12.19,21.34 12.19,21.6 IC7.59 10.92,22.87 10.92,23.37 11.05,23.5 | IC7.54 13.36,23.98 11.85,25.49 | IC7.58 11.05,23.45 11.05,23.5 | IC7.57 11.43,23.78 11.33,23.78 11.18,23.62 | 11.85,25.49 v11.85,26.25 | 11.05,23.5 11.18,23.62 | 11.85,25.49 11.18,24.81 11.18,23.62 | IC7.38 22.09,22.86 22.35,22.86 22.61,22.61 | 22.61,22.61 v22.86,22.35 | v22.86,22.35 23.11,22.1 23.11,21.77 IC7.35 | IC7.36 22.86,22.22 v22.86,22.35 | IC7.37 22.54,22.61 22.61,22.61 | IC7.43 20.88,25.18 v22.44,25.18 | IC7.32 23.88,16.99 23.88,16.76 v23.62,16.51 | v23.62,16.51 23.37,16.26 23.19,16.26 IC7.30 | IC7.31 23.62,16.53 v23.62,16.51 | IC7.24 v21.34,13.87 21.34,14.58 IC7.25 | IC7.21 20.32,12.77 v20.32,12.19
  Top 0.508: Q4.2 v15.07,56.13 | Q3.2 v15.07,51.69 | Q2.2 v15.07,47.24 | v17.14,46.99 R6.2 | Q1.2 v15.07,42.8 | v17.14,42.55 R1.2 | C8.2 v22.44,25.18 | C12.2 v11.85,26.25 | v11.85,26.25 C10.2 | C11.2 v12.7,10.58 | C4.2 v27.18,12.7 | v20.32,12.19 20.07,11.68 C5.2 21.71,9.4 22.23,8.89 IC8.3 | R4.2 11.51,26.25 v11.85,26.25 | IC1.4 v16.51,36.32 16.93,36.74 C1.2 | C6.2 v13.34,35.31 | C7.2 v39.37,45.09 | C2.2 v39.37,33.4 | C3.2 v39.37,22.23 | IC5.14 v44.45,25.4 | v46.99,25.4 IC5.12 | IC5.8 v50.8,22.86 | IC4.8 v50.8,34.29 | IC6.8 v50.8,45.72 | IC6.15 v43.18,48.26 | Q6.2 44.42,68.4 U1.2 U1.3 | QG1.2 v42.8,15.24 | Q5.2 v43.98,60.33 | R13.2 v17.14,55.88 | R10.2 v17.14,51.44 | C9.2 v41.27,8
  GND 0.508: 83.82,28.57 83.82,24.13 | 85.72,26.04 81.92,26.04 | 83.82,16.51 83.82,12.06 | 81.92,14.61 85.72,14.61 | 76.2,49.53 76.2,45.72 | 74.3,47.62 78.11,47.62 | 76.2,33.66 76.2,38.1 | 74.3,36.2 78.11,36.2
  Bottom 0.508: GPS_S.1 v71.75,25.94
  Bottom 1.016: C14.- v58.42,45.72 | v79.38,64.14 C13.-
  other vias: 2.54,5.71 2.54,8.26 2.54,9.53 2.54,12.06 2.54,15.24 2.54,16.51 2.54,19.05 2.54,22.23 2.54,23.5 5.71,7.62 5.71,5.71 6.99,8.89 8.26,10.16 9.53,11.43 5.08,11.43 6.35,12.06 7.62,13.34 5.71,13.34 5.46,15.24 6.73,15.24 5.46,16.51 6.73,16.51 8.26,18.67 6.99,18.67 5.71,18.67 9.53,19.3 8.26,20.07 6.99,20.07 5.71,20.07 5.71,22.23 6.99,22.23 6.35,23.5 5.08,23.5 2.54,26.04 5.08,26.04 6.35,26.04 7.62,26.04
  pour GND: 0.64,0.64 93.34,0.64 93.34,73.66 0.64,73.66
  pour Top: 0.64,5.08 16.51,5.08 16.51,26.67 0.64,26.67
GPS_PPS  (via drill 0.3 pad 0.7)
  Top 0.305: v39.05,43.5 TS7500.18 | IC4.10 v49.53,41.91 50.8,41.91 55.24,37.47 v55.24,29.21
  Bottom 0.305: v49.53,41.91 47.94,43.5 v39.05,43.5 | v55.24,29.21 64.14,20.32 67.31,20.32 67.94,20.95 67.94,24.13 68.48,24.67 GPS_S.3 72.3,24.67 73.03,25.4 73.03,29.84 JP4.2
LED1
  Top 0.305: R2.1 21.82,41.49 24.77,38.55 24.77,29.84 26.04,28.57 26.04,26.67 26.67,26.04 28.32,26.04 29.21,26.92 31.56,26.92 TS7500.32
LED2  (via drill 0.3 pad 0.7)
  Top 0.305: R7.1 22.01,45.94 25.4,42.55 25.4,30.48 v27.3,28.57
  Bottom 0.305: TS7500.33 28.64,23.18 27.94,23.88 27.94,27.94 v27.3,28.57
LED3  (via drill 0.3 pad 0.7)
  Top 0.305: R11.1 22.01,50.38 26.04,46.35 26.04,31.75 v26.67,31.11
  Bottom 0.305: v26.67,31.11 28.57,29.21 28.57,24.77 28.96,24.38 31.56,24.38 TS7500.34
LED4  (via drill 0.3 pad 0.7)
  Top 0.305: R14.1 22.01,54.83 26.67,50.16 26.67,33.02 28.57,31.11 28.57,28.57 v27.05,27.05
  Bottom 0.305: v27.05,27.05 27.05,22.48 28.89,20.64 TS7500.35
N$1  (via drill 0.3 pad 0.7)
  Top 0.305: IC6.1 v41.91,40.39
  Bottom 0.305: TS7500.26 33.97,33.34 41.02,40.39 v41.91,40.39
N$2  (via drill 0.3 pad 0.7)
  Top 0.305: v52.96,35.05 52.96,26.29 51.44,24.77 49.53,23.5 IC5.7 | v43.18,36.83 IC4.15
  Bottom 0.305: v43.18,36.83 44.96,35.05 v52.96,35.05
N$3  (via drill 0.3 pad 0.7)
  Top 0.305: IC4.14 v44.45,36.83 | v53.98,35.94 53.98,21.59 51.44,19.05 46.35,19.05 45.72,19.68 IC5.4
  Bottom 0.305: v44.45,36.83 45.34,35.94 v53.98,35.94
N$4  (via drill 0.3 pad 0.7)
  Top 0.254: IC7.11 12.7,13.47 12.7,11.68 13.46,10.92
  Top 0.305: v24.77,5.08 18.54,5.08 16.76,6.86 16.76,7.62 13.46,10.92 | v50.8,40.64 IC4.9
  Bottom 0.305: v24.77,5.08 28.45,8.76 28.45,13.21 29.46,14.22 33.78,14.22 43.18,23.62 43.18,26.67 46.99,30.48 50.16,30.48 55.24,35.56 55.24,38.1 52.7,40.64 v50.8,40.64
N$5
  Top 0.305: IC4.4 IC4.13
N$7  (via drill 0.3 pad 0.7)
  Top 0.254: IC7.29 22.99,15.75 24.13,15.75 27.69,19.3
  Top 0.305: IC4.12 v46.99,34.29 | 27.69,19.3 33.78,19.3 36.83,22.35 v36.83,32.38
  Bottom 0.305: v46.99,34.29 45.09,32.38 38.73,32.38 v36.83,32.38
N$8
  Top 0.254: X1.2 6.2,10.64 8.89,13.34 8.89,15.32 IC7.3
N$9
  Top 0.305: R19.2 42.76,63.72 42.86,63.82 42.87,63.81 Q5.1
N$10
  Top 0.254: IC7.4 9.53,15.25 9.53,12.88 X1.1
N$11
  Top 0.254: IC7.1 9.3,17.14 8.26,17.14 7.76,17.64 X1.4
N$12
  Top 0.254: IC7.61 8.64,23.74 8.64,29.21 8.98,29.55 R4.1 R3.1
N$13
  Bottom 0.508: USBB.D- 79.3,40.08 77.47,41.91 74.93,41.91 USBA.D+
N$14
  Top 0.254: IC7.63 6.32,24.64 X1.6
N$15
  Top 0.305: Q2.1 16.2,44.13 16.3,44.23 R6.1 R7.2
N$16
  Top 0.305: R9.1 12.02,45.94 Q2.3
N$17
  Top 0.254: IC7.27 22.6,14.73 25.65,14.73
  Top 0.305: 25.65,14.73 27.69,16.76 35.96,16.76 QG1.3 40.64,18.42 40.64,22.23 42.55,24.13 45.09,24.13 45.72,24.77 IC5.13
N$18
  Top 0.508: USBB.D+ 81.28,27.3 71.75,36.83 71.75,40.01 72.53,40.78 USBA.D-
N$19  (via drill 0.3 pad 0.7)
  Top 0.254: v10.42,14.72 10.42,15.44 IC7.5 10.41,15.43 v10.41,14.73 v10.42,14.72 | C11.1 11.43,13.21 10.42,14.22 v10.42,14.72 | C10.1 13.55,26 v13.46,25.91 13.21,25.65 13.21,24.83 IC7.53 | IC7.44 20.1,25.11 | 20.1,25.11 20.74,25.75 C8.1 | v19.3,25.91 20.1,25.11 | v10.16,23.37 10.16,23.11 | IC7.60 10.16,22.93 v10.16,23.37 | C12.1 9.91,23.62 v10.16,23.37
  Top 0.508: L1.1 v24.77,24.77
  PWR 0.508: v10.41,14.73 10.41,19.56 10.16,19.81 v10.16,23.37 10.79,24 10.79,24.77 11.43,25.4 12.95,25.4 v13.46,25.91 v19.3,25.91 20.07,26.67 22.86,26.67 v24.77,24.77
N$20
  Top 0.305: X1.9 8.26,39.61 8.26,41.7 R9.2
N$21
  Top 0.305: Q3.1 16.2,48.58 16.3,48.68 R10.1 R11.2
N$22
  Top 0.305: R12.1 12.02,50.38 Q3.3
N$23
  Top 0.305: X2.2 6.9,45.81 7.92,45.81 R12.2
N$24
  Top 0.305: Q4.1 16.2,53.02 16.3,53.12 R13.1 R14.2
N$25
  Top 0.305: R15.1 12.02,54.83 Q4.3
N$26
  Top 0.305: X2.4 7.37,49.7 R15.2
N$27
  Bottom 1.016: X2.9 7.51,67.2 7.62,67.31 JP2.1
N$28
  Bottom 0.508: X1.8 1.91,33.52 1.91,39.2 | 1.91,39.2 1.91,46.2 | 1.91,46.2 1.91,51.32 X2.5 9.01,58.42 JP3.1 | X2.3 1.91,46.2 | X2.1 1.91,39.2
N$29
  Top 0.254: IC7.2 7,14.14 X1.3
N$31
  Top 0.305: Q5.3 46.19,64.6 46.35,64.77 R18.2 44.38,66.46 Q6.1 17.46,66.36 15.88,64.77 12.7,64.77 JP1.2
  Bottom 0.508: X2.7 8.13,60.2 JP1.2
N$32
  Top 0.305: Q6.3 42.08,69.05 41.88,69.25 U1.1
N$34
  Top 0.254: IC7.64 9.12,21.14 X1.5
N$37
  Top 0.305: R5.1 12.02,41.49 Q1.3
N$39
  Top 0.305: Q1.1 16.2,39.69 16.3,39.79 R1.1 R2.2
N$40
  Top 0.305: X1.7 8.26,32.61 8.26,37.25 R5.2
N$42  (via drill 0.3 pad 0.7)
  Top 0.305: TS7500.6 33.97,58.74 39.37,53.34 52.7,53.34 57.15,48.9 57.15,42.55 v59.05,40.64
  Bottom 0.305: GPS_S.2 66.12,33.58 v59.05,40.64
N$43  (via drill 0.3 pad 0.7)
  Top 0.305: TS7500.5 31.56,57.4 33.78,57.4 38.48,52.7 52.07,52.7 56.52,48.26 56.52,41.27 v57.78,40.01
  Bottom 0.305: GPS_S.4 64.86,24.67 64.14,25.4 64.14,33.66 v57.78,40.01
N$44  (via drill 0.3 pad 0.7)
  Top 0.305: R8.2 v64.19,23.55
  Bottom 0.305: GPS_S.6 64.33,23.4 v64.19,23.55
ON  (via drill 0.3 pad 0.7)
  Top 0.305: TS7500.36 34.92,22.8 v34.92,40.64 | R19.1 v38.73,58.84
  Bottom 0.305: v38.73,58.84 34.92,55.03 v34.92,40.64
SPI_CLOCK  (via drill 0.3 pad 0.7)
  Top 0.254: IC7.28 22.8,15.24 24.13,15.24
  Top 0.305: v26.29,16.76 24.77,15.24 24.13,15.24
  Bottom 0.305: TS7500.14 31.43,47.24 29.46,47.24 25.4,43.18 25.4,31.11 26.29,30.23 v26.29,16.76
(copper drawn outside any net)
  shapes: Bottom area x4

### Text on the board
tPlace: INESC-ID MIAVITA V3 | +BAT- | MAIN SW | ON SW | ON | LED ON | +LD4- | +LD3- | +LD2- | +LD1- | +S3- | +S2- | +S1- | INESC-ID | MIAVITA V3
bPlace: INESC-ID MIAVITA V3 | -BAT+ | MAIN SW | ON SW | ON | LED ON | -LD4+ | -LD3+ | -LD2+ | -LD1+ | -S3+ | -S2+ | -S1+